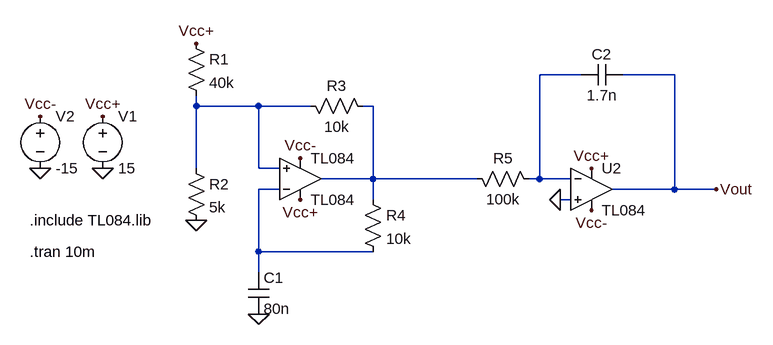
[diagram p0: schematic emmeteur.asc]
emmeteur.asc, the LTspice schematic file:
Version 4
SHEET 1 880 680
WIRE 560 64 496 64
WIRE 704 64 624 64
WIRE -32 112 -32 96
WIRE 64 112 -32 112
WIRE 144 112 64 112
WIRE 240 112 224 112
WIRE -32 208 -32 112
WIRE 64 208 64 112
WIRE 96 208 64 208
WIRE 240 224 240 112
WIRE 240 224 160 224
WIRE 400 224 240 224
WIRE 496 224 496 64
WIRE 496 224 480 224
WIRE 544 224 496 224
WIRE 96 240 64 240
WIRE 704 240 704 64
WIRE 704 240 608 240
WIRE 768 240 704 240
WIRE 240 256 240 224
WIRE 544 256 528 256
WIRE 64 336 64 240
WIRE 240 336 64 336
WIRE 64 368 64 336
FLAG -176 128 Vcc+
FLAG -272 128 Vcc-
FLAG 64 432 0
FLAG -32 288 0
FLAG -32 16 Vcc+
FLAG -272 208 0
FLAG -176 208 0
FLAG 128 192 Vcc-
FLAG 128 256 Vcc+
FLAG 528 256 0
FLAG 576 208 Vcc+
FLAG 576 272 Vcc-
FLAG 768 240 Vout
SYMBOL res -48 0 R0
SYMATTR InstName R1
SYMATTR Value 40k
SYMBOL res -48 192 R0
SYMATTR InstName R2
SYMATTR Value 5k
SYMBOL res 128 96 M90
WINDOW 0 0 56 VBottom 2
WINDOW 3 32 56 VTop 2
SYMATTR InstName R3
SYMATTR Value 10k
SYMBOL Opamps\\opamp2 128 288 M180
SYMATTR InstName TL084
SYMATTR Value TL084
SYMBOL res 224 240 R0
SYMATTR InstName R4
SYMATTR Value 10k
SYMBOL cap 48 368 R0
SYMATTR InstName C1
SYMATTR Value 80n
SYMBOL voltage -176 112 R0
WINDOW 123 0 0 Left 0
WINDOW 39 0 0 Left 0
SYMATTR InstName V1
SYMATTR Value 15
SYMBOL voltage -272 112 R0
WINDOW 123 0 0 Left 0
WINDOW 39 0 0 Left 0
SYMATTR InstName V2
SYMATTR Value -15
SYMBOL res 384 208 M90
WINDOW 0 0 56 VBottom 2
WINDOW 3 32 56 VTop 2
SYMATTR InstName R5
SYMATTR Value 100k
SYMBOL Opamps\\opamp2 576 176 R0
SYMATTR InstName U2
SYMATTR Value TL084
SYMBOL cap 624 48 R90
WINDOW 0 0 32 VBottom 2
WINDOW 3 32 32 VTop 2
SYMATTR InstName C2
SYMATTR Value 1.7n
TEXT -288 288 Left 2 !.include TL084.lib
TEXT -288 336 Left 2 !.tran 10m

The netlist it stands for:
* emmeteur.asc
R1 Vcc+ N002 40k
R2 N002 0 5k
R3 N002 N003 10k
XTL084 N002 N004 Vcc+ Vcc- N003 TL084  ; pins In+ In- V+ V- OUT
R4 N003 N004 10k
C1 N004 0 80n
V1 Vcc+ 0 15
V2 Vcc- 0 -15
R5 N003 N001 100k
XU2 0 N001 Vcc+ Vcc- Vout TL084  ; pins In+ In- V+ V- OUT
C2 Vout N001 1.7n
.include TL084.lib
.tran 10m
.backanno
.end